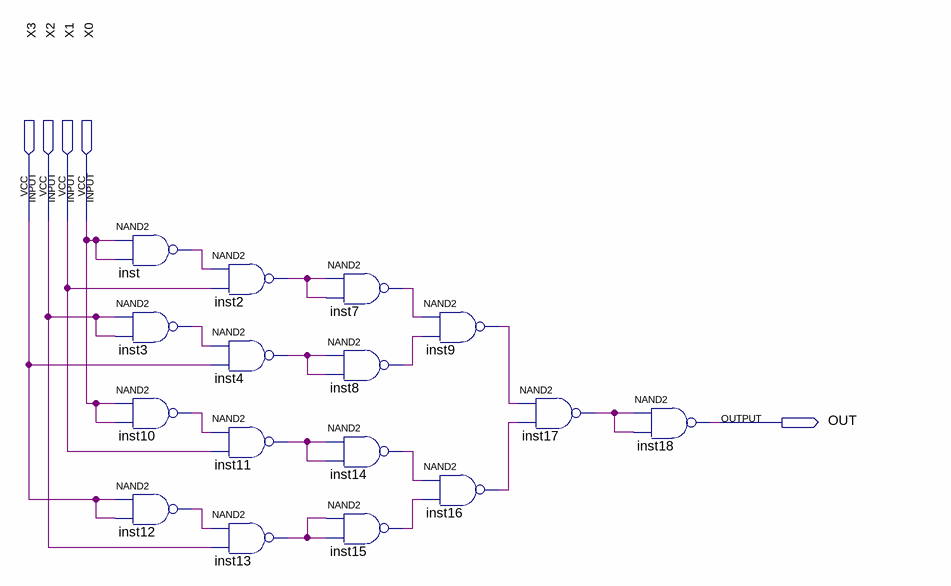
[diagram p0: schematic sheet]
// Quartus schematic B.bdf as structural Verilog: 16 symbols, 5 pins
module B (
  input  X3,
  input  X2,
  input  X1,
  input  X0,
  output OUT
);

  wire inst2_out, inst3_out, inst4_out, inst7_out, inst8_out, inst9_out, inst10_out, inst11_out, inst12_out,
       inst13_out, inst14_out, inst15_out, inst16_out, inst17_out, inst_out;

  nand inst (inst_out, X0, X0);
  nand inst3 (inst3_out, X2, X2);
  nand inst10 (inst10_out, X0, X0);
  nand inst12 (inst12_out, X3, X3);
  nand inst2 (inst2_out, inst_out, X1);
  nand inst4 (inst4_out, inst3_out, X3);
  nand inst11 (inst11_out, inst10_out, X1);
  nand inst13 (inst13_out, inst12_out, X2);
  nand inst7 (inst7_out, inst2_out, inst2_out);
  nand inst8 (inst8_out, inst4_out, inst4_out);
  nand inst14 (inst14_out, inst11_out, inst11_out);
  nand inst15 (inst15_out, inst13_out, inst13_out);
  nand inst9 (inst9_out, inst7_out, inst8_out);
  nand inst16 (inst16_out, inst14_out, inst15_out);
  nand inst17 (inst17_out, inst9_out, inst16_out);
  nand inst18 (OUT, inst17_out, inst17_out);
endmodule
